# Altium schematic sheet SubBus9.SchDoc
size A
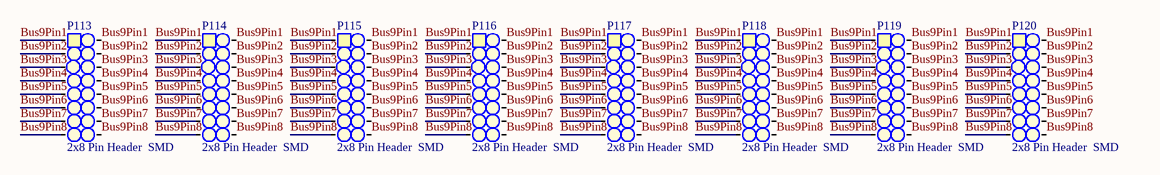
[diagram p0: SubBus9.SchDoc]

## Parts
P113  2x8 Pin Header  SMD  [2X8_SMD_PH_2.54]
P114  2x8 Pin Header  SMD  [2X8_SMD_PH_2.54]
P115  2x8 Pin Header  SMD  [2X8_SMD_PH_2.54]
P116  2x8 Pin Header  SMD  [2X8_SMD_PH_2.54]
P117  2x8 Pin Header  SMD  [2X8_SMD_PH_2.54]
P118  2x8 Pin Header  SMD  [2X8_SMD_PH_2.54]
P119  2x8 Pin Header  SMD  [2X8_SMD_PH_2.54]
P120  2x8 Pin Header  SMD  [2X8_SMD_PH_2.54]

## Nets
Bus9Pin1: P113.1 P113.16 P114.1 P114.16 P115.1 P115.16 P116.1 P116.16 P117.1 P117.16 P118.1 P118.16 P119.1 P119.16 P120.1 P120.16
Bus9Pin2: P113.2 P113.15 P114.2 P114.15 P115.2 P115.15 P116.2 P116.15 P117.2 P117.15 P118.2 P118.15 P119.2 P119.15 P120.2 P120.15
Bus9Pin3: P113.3 P113.14 P114.3 P114.14 P115.3 P115.14 P116.3 P116.14 P117.3 P117.14 P118.3 P118.14 P119.3 P119.14 P120.3 P120.14
Bus9Pin4: P113.4 P113.13 P114.4 P114.13 P115.4 P115.13 P116.4 P116.13 P117.4 P117.13 P118.4 P118.13 P119.4 P119.13 P120.4 P120.13
Bus9Pin5: P113.5 P113.12 P114.5 P114.12 P115.5 P115.12 P116.5 P116.12 P117.5 P117.12 P118.5 P118.12 P119.5 P119.12 P120.5 P120.12
Bus9Pin6: P113.6 P113.11 P114.6 P114.11 P115.6 P115.11 P116.6 P116.11 P117.6 P117.11 P118.6 P118.11 P119.6 P119.11 P120.6 P120.11
Bus9Pin7: P113.7 P113.10 P114.7 P114.10 P115.7 P115.10 P116.7 P116.10 P117.7 P117.10 P118.7 P118.10 P119.7 P119.10 P120.7 P120.10
Bus9Pin8: P113.8 P113.9 P114.8 P114.9 P115.8 P115.9 P116.8 P116.9 P117.8 P117.9 P118.8 P118.9 P119.8 P119.9 P120.8 P120.9

## Library data of the parts
P113-P120 = 2x8 Pin Header  SMD: 2.54mm, SMD; Value: 2x8 Pin Header, 2.54mm, SMD; Farnell: 2356242